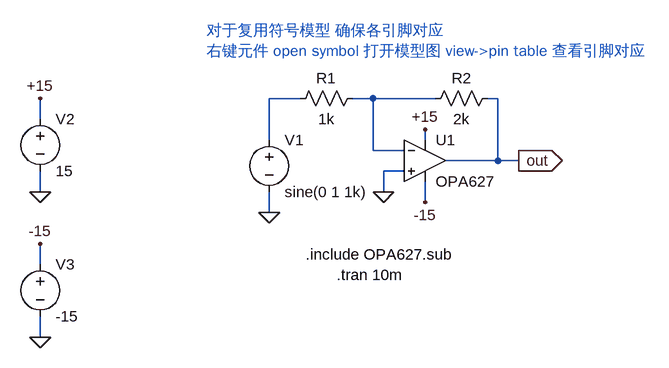
[diagram p0: schematic Draft2.asc]
Draft2.asc, the LTspice schematic file:
Version 4.1
SHEET 1 880 680
WIRE 64 32 16 32
WIRE 176 32 144 32
WIRE 272 32 176 32
WIRE 368 32 352 32
WIRE -336 64 -336 32
WIRE 16 96 16 32
WIRE 256 96 256 80
WIRE 176 112 176 32
WIRE 224 112 176 112
WIRE 368 128 368 32
WIRE 368 128 288 128
WIRE 400 128 368 128
WIRE 224 144 192 144
WIRE -336 176 -336 144
WIRE 192 176 192 144
WIRE 256 192 256 160
WIRE 16 208 16 176
WIRE -336 288 -336 256
WIRE -336 400 -336 368
FLAG 192 176 0
FLAG 16 208 0
FLAG -336 176 0
FLAG -336 400 0
FLAG -336 32 +15
FLAG -336 256 -15
FLAG 256 80 +15
FLAG 256 192 -15
FLAG 400 128 out
IOPIN 400 128 Out
SYMBOL OpAmps\\opamp2 256 64 R0
SYMATTR InstName U1
SYMATTR Value OPA627
SYMBOL voltage 16 80 R0
SYMATTR InstName V1
SYMATTR Value sine(0 1 1k)
SYMBOL res 160 16 R90
WINDOW 0 0 56 VBottom 2
WINDOW 3 32 56 VTop 2
SYMATTR InstName R1
SYMATTR Value 1k
SYMBOL res 368 16 R90
WINDOW 0 0 56 VBottom 2
WINDOW 3 32 56 VTop 2
SYMATTR InstName R2
SYMATTR Value 2k
SYMBOL voltage -336 48 R0
SYMATTR InstName V2
SYMATTR Value 15
SYMBOL voltage -336 272 R0
SYMATTR InstName V3
SYMATTR Value -15
TEXT 72 272 Left 2 !.include OPA627.sub
TEXT 120 304 Left 2 !.tran 10m
TEXT -80 -72 Left 2 ;对于复用符号模型 确保各引脚对应\n右键元件 open symbol 打开模型图 view->pin table 查看引脚对应

The netlist it stands for:
* Draft2.asc
X§U1 0 N002 +15 -15 out OPA627  ; pins In+ In- V+ V- OUT
V1 N001 0 sine(0 1 1k)
R1 N002 N001 1k
R2 out N002 2k
V2 +15 0 15
V3 -15 0 -15
.include OPA627.sub
.tran 10m
* 对于复用符号模型 确保各引脚对应
* 右键元件 open symbol 打开模型图 view->pin table 查看引脚对应
.backanno
.end